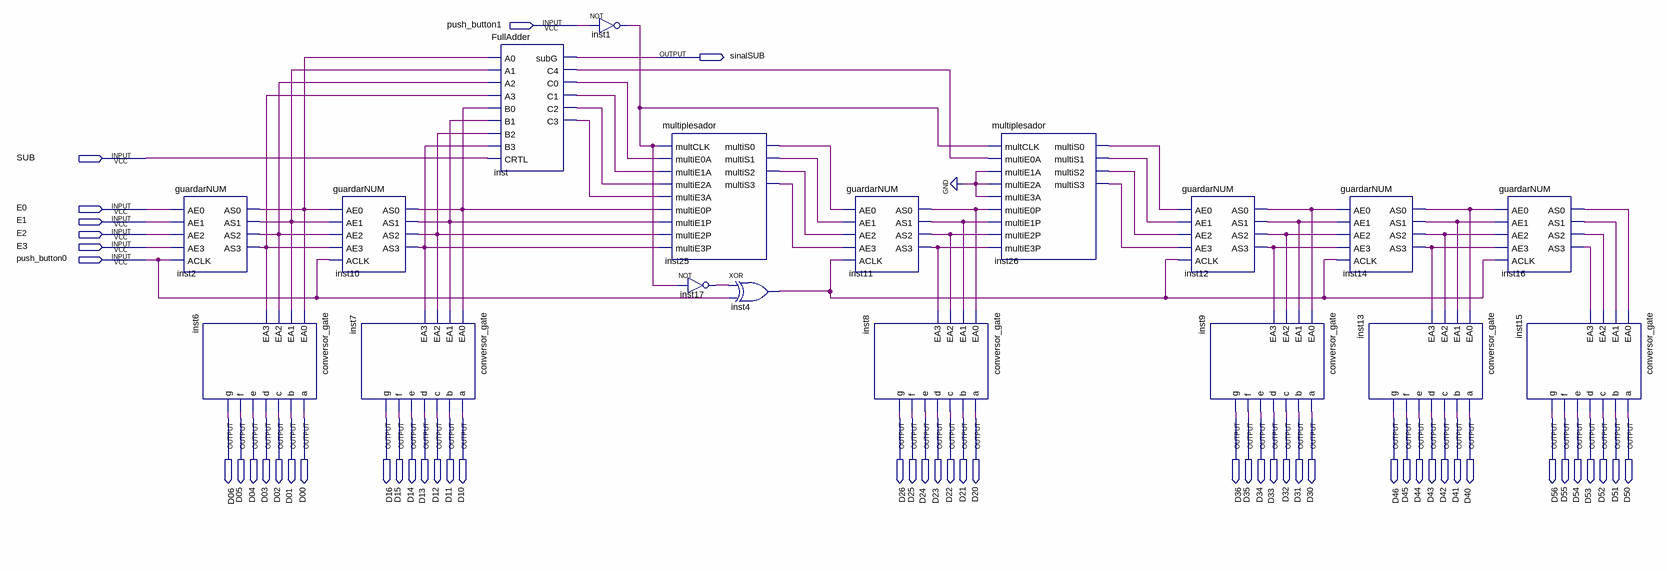
[diagram p0: schematic sheet]
// Quartus schematic registrador.bdf as structural Verilog: 18 symbols, 50 pins
module registrador (
  input  push_button1,
  input  SUB,
  input  E0,
  input  E1,
  input  E2,
  input  E3,
  input  push_button0,
  output sinalSUB,
  output D06,
  output D05,
  output D04,
  output D03,
  output D02,
  output D01,
  output D00,
  output D16,
  output D15,
  output D14,
  output D13,
  output D12,
  output D11,
  output D10,
  output D26,
  output D25,
  output D24,
  output D23,
  output D22,
  output D21,
  output D20,
  output D36,
  output D35,
  output D34,
  output D33,
  output D32,
  output D31,
  output D30,
  output D46,
  output D45,
  output D44,
  output D43,
  output D42,
  output D41,
  output D40,
  output D56,
  output D55,
  output D54,
  output D53,
  output D52,
  output D51,
  output D50
);

  wire inst1_out, inst2_as0, inst2_as1, inst2_as2, inst2_as3, inst4_out, inst10_as0, inst10_as1, inst10_as2,
       inst10_as3, inst11_as0, inst11_as1, inst11_as2, inst11_as3, inst12_as0, inst12_as1, inst12_as2,
       inst12_as3, inst14_as0, inst14_as1, inst14_as2, inst14_as3, inst16_as0, inst16_as1, inst16_as2,
       inst16_as3, inst17_out, inst25_multis0, inst25_multis1, inst25_multis2, inst25_multis3,
       inst26_multis0, inst26_multis1, inst26_multis2, inst26_multis3, inst_c0, inst_c1, inst_c2, inst_c3,
       inst_c4;

  guardarNUM inst2 (
    .AE0(E0), .AE1(E1), .AE2(E2), .AE3(E3), .ACLK(push_button0), .AS0(inst2_as0), .AS1(inst2_as1),
    .AS2(inst2_as2), .AS3(inst2_as3));
  conversor_gate inst6 (
    .EA0(inst2_as0), .EA1(inst2_as1), .EA2(inst2_as2), .EA3(inst2_as3), .a(D00), .b(D01), .c(D02), .d(D03),
    .e(D04), .f(D05), .g(D06));
  guardarNUM inst10 (
    .AE0(inst2_as0), .AE1(inst2_as1), .AE2(inst2_as2), .AE3(inst2_as3), .ACLK(push_button0),
    .AS0(inst10_as0), .AS1(inst10_as1), .AS2(inst10_as2), .AS3(inst10_as3));
  conversor_gate inst7 (
    .EA0(inst10_as0), .EA1(inst10_as1), .EA2(inst10_as2), .EA3(inst10_as3), .a(D10), .b(D11), .c(D12),
    .d(D13), .e(D14), .f(D15), .g(D16));
  FullAdder inst (
    .A0(inst2_as0), .A1(inst2_as1), .A2(inst2_as2), .A3(inst2_as3), .B0(inst10_as0), .B1(inst10_as1),
    .B2(inst10_as2), .B3(inst10_as3), .CRTL(SUB), .subG(sinalSUB), .C4(inst_c4), .C0(inst_c0), .C1(inst_c1),
    .C2(inst_c2), .C3(inst_c3));
  not inst1 (inst1_out, push_button1);
  multiplesador inst25 (
    .multCLK(inst1_out), .multiE0A(inst_c0), .multiE1A(inst_c1), .multiE2A(inst_c2), .multiE3A(inst_c3),
    .multiE0P(inst10_as0), .multiE1P(inst10_as1), .multiE2P(inst10_as2), .multiE3P(inst10_as3),
    .multiS0(inst25_multis0), .multiS1(inst25_multis1), .multiS2(inst25_multis2), .multiS3(inst25_multis3));
  not inst17 (inst17_out, inst1_out);
  xor inst4 (inst4_out, inst17_out, push_button0);
  guardarNUM inst11 (
    .AE0(inst25_multis0), .AE1(inst25_multis1), .AE2(inst25_multis2), .AE3(inst25_multis3), .ACLK(inst4_out),
    .AS0(inst11_as0), .AS1(inst11_as1), .AS2(inst11_as2), .AS3(inst11_as3));
  conversor_gate inst8 (
    .EA0(inst11_as0), .EA1(inst11_as1), .EA2(inst11_as2), .EA3(inst11_as3), .a(D20), .b(D21), .c(D22),
    .d(D23), .e(D24), .f(D25), .g(D26));
  multiplesador inst26 (
    .multCLK(inst1_out), .multiE0A(inst_c4), .multiE1A(1'b0), .multiE2A(1'b0), .multiE3A(1'b0),
    .multiE0P(inst11_as0), .multiE1P(inst11_as1), .multiE2P(inst11_as2), .multiE3P(inst11_as3),
    .multiS0(inst26_multis0), .multiS1(inst26_multis1), .multiS2(inst26_multis2), .multiS3(inst26_multis3));
  guardarNUM inst12 (
    .AE0(inst26_multis0), .AE1(inst26_multis1), .AE2(inst26_multis2), .AE3(inst26_multis3), .ACLK(inst4_out),
    .AS0(inst12_as0), .AS1(inst12_as1), .AS2(inst12_as2), .AS3(inst12_as3));
  conversor_gate inst9 (
    .EA0(inst12_as0), .EA1(inst12_as1), .EA2(inst12_as2), .EA3(inst12_as3), .a(D30), .b(D31), .c(D32),
    .d(D33), .e(D34), .f(D35), .g(D36));
  guardarNUM inst14 (
    .AE0(inst12_as0), .AE1(inst12_as1), .AE2(inst12_as2), .AE3(inst12_as3), .ACLK(inst4_out),
    .AS0(inst14_as0), .AS1(inst14_as1), .AS2(inst14_as2), .AS3(inst14_as3));
  conversor_gate inst13 (
    .EA0(inst14_as0), .EA1(inst14_as1), .EA2(inst14_as2), .EA3(inst14_as3), .a(D40), .b(D41), .c(D42),
    .d(D43), .e(D44), .f(D45), .g(D46));
  guardarNUM inst16 (
    .AE0(inst14_as0), .AE1(inst14_as1), .AE2(inst14_as2), .AE3(inst14_as3), .ACLK(inst4_out),
    .AS0(inst16_as0), .AS1(inst16_as1), .AS2(inst16_as2), .AS3(inst16_as3));
  conversor_gate inst15 (
    .EA0(inst16_as0), .EA1(inst16_as1), .EA2(inst16_as2), .EA3(inst16_as3), .a(D50), .b(D51), .c(D52),
    .d(D53), .e(D54), .f(D55), .g(D56));
endmodule
